# Altium project Huckepack.PrjPcb
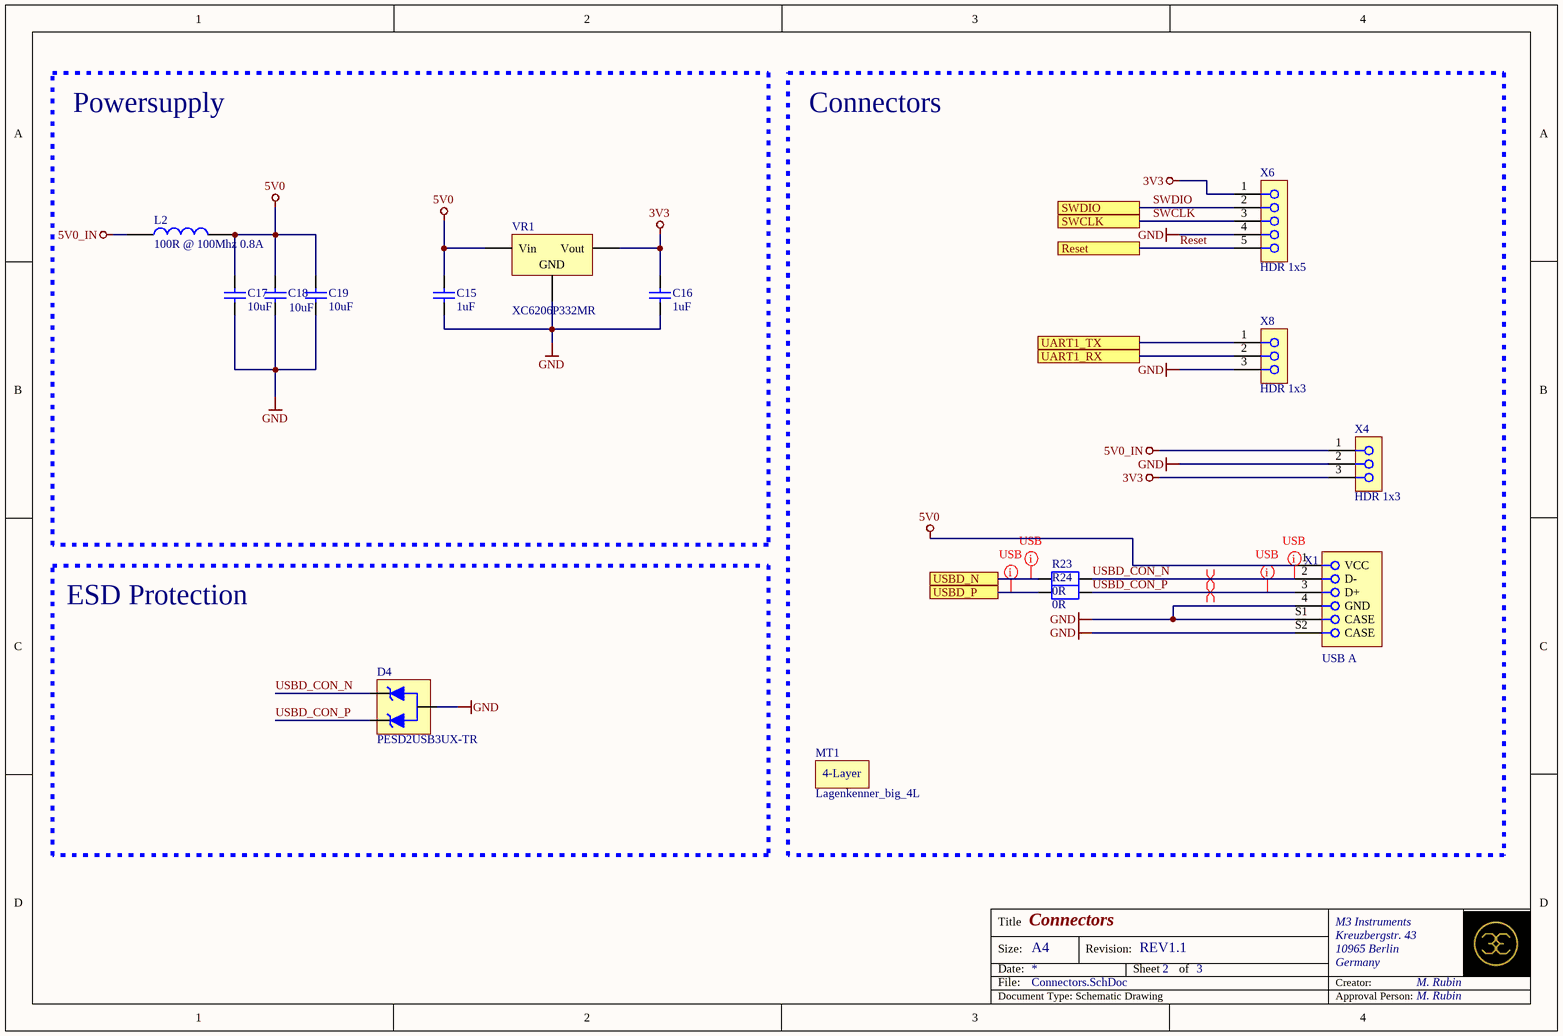
[diagram p0: Connectors.SchDoc]
Address2: Kreuzbergstr. 43; Address3: 10965 Berlin; Address4: Germany; ApprovalSchematic: M. Rubin; CompanyName: M3 Instruments; CreatorSchematic: M. Rubin; ProjectRevision: REV1.1
3 sheets, 167 parts. Net scope: flat (ports and power ports of the same name join across sheets).
Board file: hep-0002.PcbDoc
Sheets:
  Connectors.SchDoc
  MCU.SchDoc
  Audiocodec.SchDoc

## Sheet Connectors.SchDoc: Connectors
size A4; DocumentNumber: 2; SheetNumber: 2; SheetTotal: 3

### Parts
C15  1uF  [0603_C]
C16  1uF  [0603_C]
C17  10uF  [0805_C]
C18  10uF  [0805_C]
C19  10uF  [0805_C]
D4  PESD2USB3UX-TR  [SOT95P280X135-3N_123]
L2  100R @ 100Mhz 0.8A  [6-0805_L]
MT1  Lagenkenner_big_4L  [Lagenkenner_4L-big]
R23  0R  [RESC2012X70N]
R24  0R  [RESC2012X70N]
VR1  XC6206P332MR  [SOT-23-3L]
X1  USB A  [CON_USBA_F_61400416021]
X4  HDR 1x3  [CON_HEADER2.54_1x3W]
X6  HDR 1x5  [CON_HEADER2.54_1x5W]
X8  HDR 1x3  [CON_HEADER2.54_1x3W]

### Blocks framed on the sheet
Powersupply: C15-C19 L2 VR1
Connectors: MT1 R23 R24 X1 X4 X6 X8
ESD Protection: D4

### Ports
Reset, SWCLK, SWDIO, UART1_RX, UART1_TX, USBD_N, USBD_P

### Nets
3V3: C16.2 VR1.2(Vout) X4.3 X6.1
5V0: C15.2 C17.2 C18.2 C19.2 L2.2 VR1.3(Vin) X1.1(VCC)
5V0_IN: L2.1 X4.1
GND: C15.1 C16.1 C17.1 C18.1 C19.1 D4.3 VR1.1(GND) X1.4(GND) X1.S1(CASE) X1.S2(CASE) X4.2 X6.4 X8.3
Reset: X6.5 ; port Reset
SWCLK: X6.3 ; port SWCLK
SWDIO: X6.2 ; port SWDIO
USBD_CON_N: D4.1 R23.2 X1.2(D-)
USBD_CON_P: D4.2 R24.2 X1.3(D+)
USBD_N: R23.1 ; port USBD_N
USBD_P: R24.1 ; port USBD_P
NetIC1_30: X8.1 ; port UART1_TX
NetIC1_31: X8.2 ; port UART1_RX

### Layout directives
differential pair; net class USB; differential pair class USB_Line; rule Differential Pairs Routing [Pref Gap = 0.15mm    Min Gap  = 0.15mm    Max Gap  = 0.15mmPref Width = 0.5mm    Min Width  = 0.15mm    Max Width  = 0.5mm]: USBD_CON_N, USBD_CON_P
net class USB: USBD_CON_N, USBD_CON_P, USBD_N, USBD_P

### Notes on the sheet
- Title
- Size:
- Date:
- File:
- A4
- Revision:
- Sheet
- of
- Creator:
- Document Type: Schematic Drawing
- Approval Person:
- (in symbol Lagenkenner_big_4L) 4-Layer

### Library data of the parts
C15 C16 = 0603 1uF (105) 10% 50V: Chip capacitors; Manufacturer: Samsung Electro-Mechanics; PartNumber: CL10A105KB8NNNC; Tolerance: 10%; Voltage: 50V; ComponentLink1Description: Supplier link; ComponentLink1URL: http://www.szlcsc.com/product/details_16531.html; Package: 0603; Supplier: LC; SuppliersPartNumber: C15849; Capacitance: 1uF
C17-C19 = 0805 10uF (106) 10% 25V: Chip capacitors; Manufacturer: Samsung Electro-Mechanics; PartNumber: CL21A106KAYNNNE; Tolerance: 10%; Voltage: 25V; ComponentLink1Description: Supplier link; ComponentLink1URL: http://www.szlcsc.com/product/details_16532.html; Package: 0805; Supplier: LC; SuppliersPartNumber: C15850; Capacitance: 10uF
D4 = PESD2USB3UX-TR: ESD Suppressors / TVS Diodes DIODE ESD PROT; Manufacturer: Nexperia; Voltage Rating: 3.3V; Alternatives allowed: YES; Manufacturer Part Number: PESD2USB3UX-TR
L2 = 0805 100R@100Mhz 0.8A: Ferrite Bead; Notepad: *; Package: 0805; Supplier: Sunlord; SuppliersPartNumber: C1015
R23 R24 = RES_0R_0805: Thick Film Resistors - SMD 1/8watt ZEROohm Jumper; Manufacturer: Vishay; Manufacturer Part Number: CRCW08050000Z0EA; Voltage Rating: 150V; Tolerance: 1%; Alternatives allowed: YES; JLC: C17477
VR1 = SOT-23 XC6206P332MR: 低压差线性稳压(LDO); ComponentLink1Description: 供应商链接; ComponentLink1URL: http://www.szlcsc.com/product/details_5896.html; Package: SOT-23; Supplier: LC; SuppliersPartNumber: C5446
X1 = CON_USB_A_FEMALE: USB 2.0 Type A Horizontal; Manufacturer Part Number: 61400416021; Manufacturer: WURTH ELEKTRONIK; Lumira Part Number: S-QMS-SPEC-32510; Alternatives allowed: NO; Notes: *; Tolerance: *; Voltage Rating: *
X4 X8 = CON_HEADER_1X3: Board-to-Board-Steckverbinder, 2.54 mm, 3 Kontakt(e), Stiftleiste 1-Reihig; Manufacturer: Samtec; Manufacturer Part Number: TSW-103-07-T-S; Lumira Part Number: S-QMS-SPEC-32502; Alternatives allowed: YES
X6 = CON_HEADER_1X5: Board-to-Board-Steckverbinder, 2.54 mm, 5 Kontakt(e), Stiftleiste 1-Reihig; Manufacturer: Samtec; Manufacturer Part Number: TSW-105-07-T-S; Alternatives allowed: YES

## Sheet MCU.SchDoc: MCU
size A3; DocumentNumber: 1; SheetNumber: 1
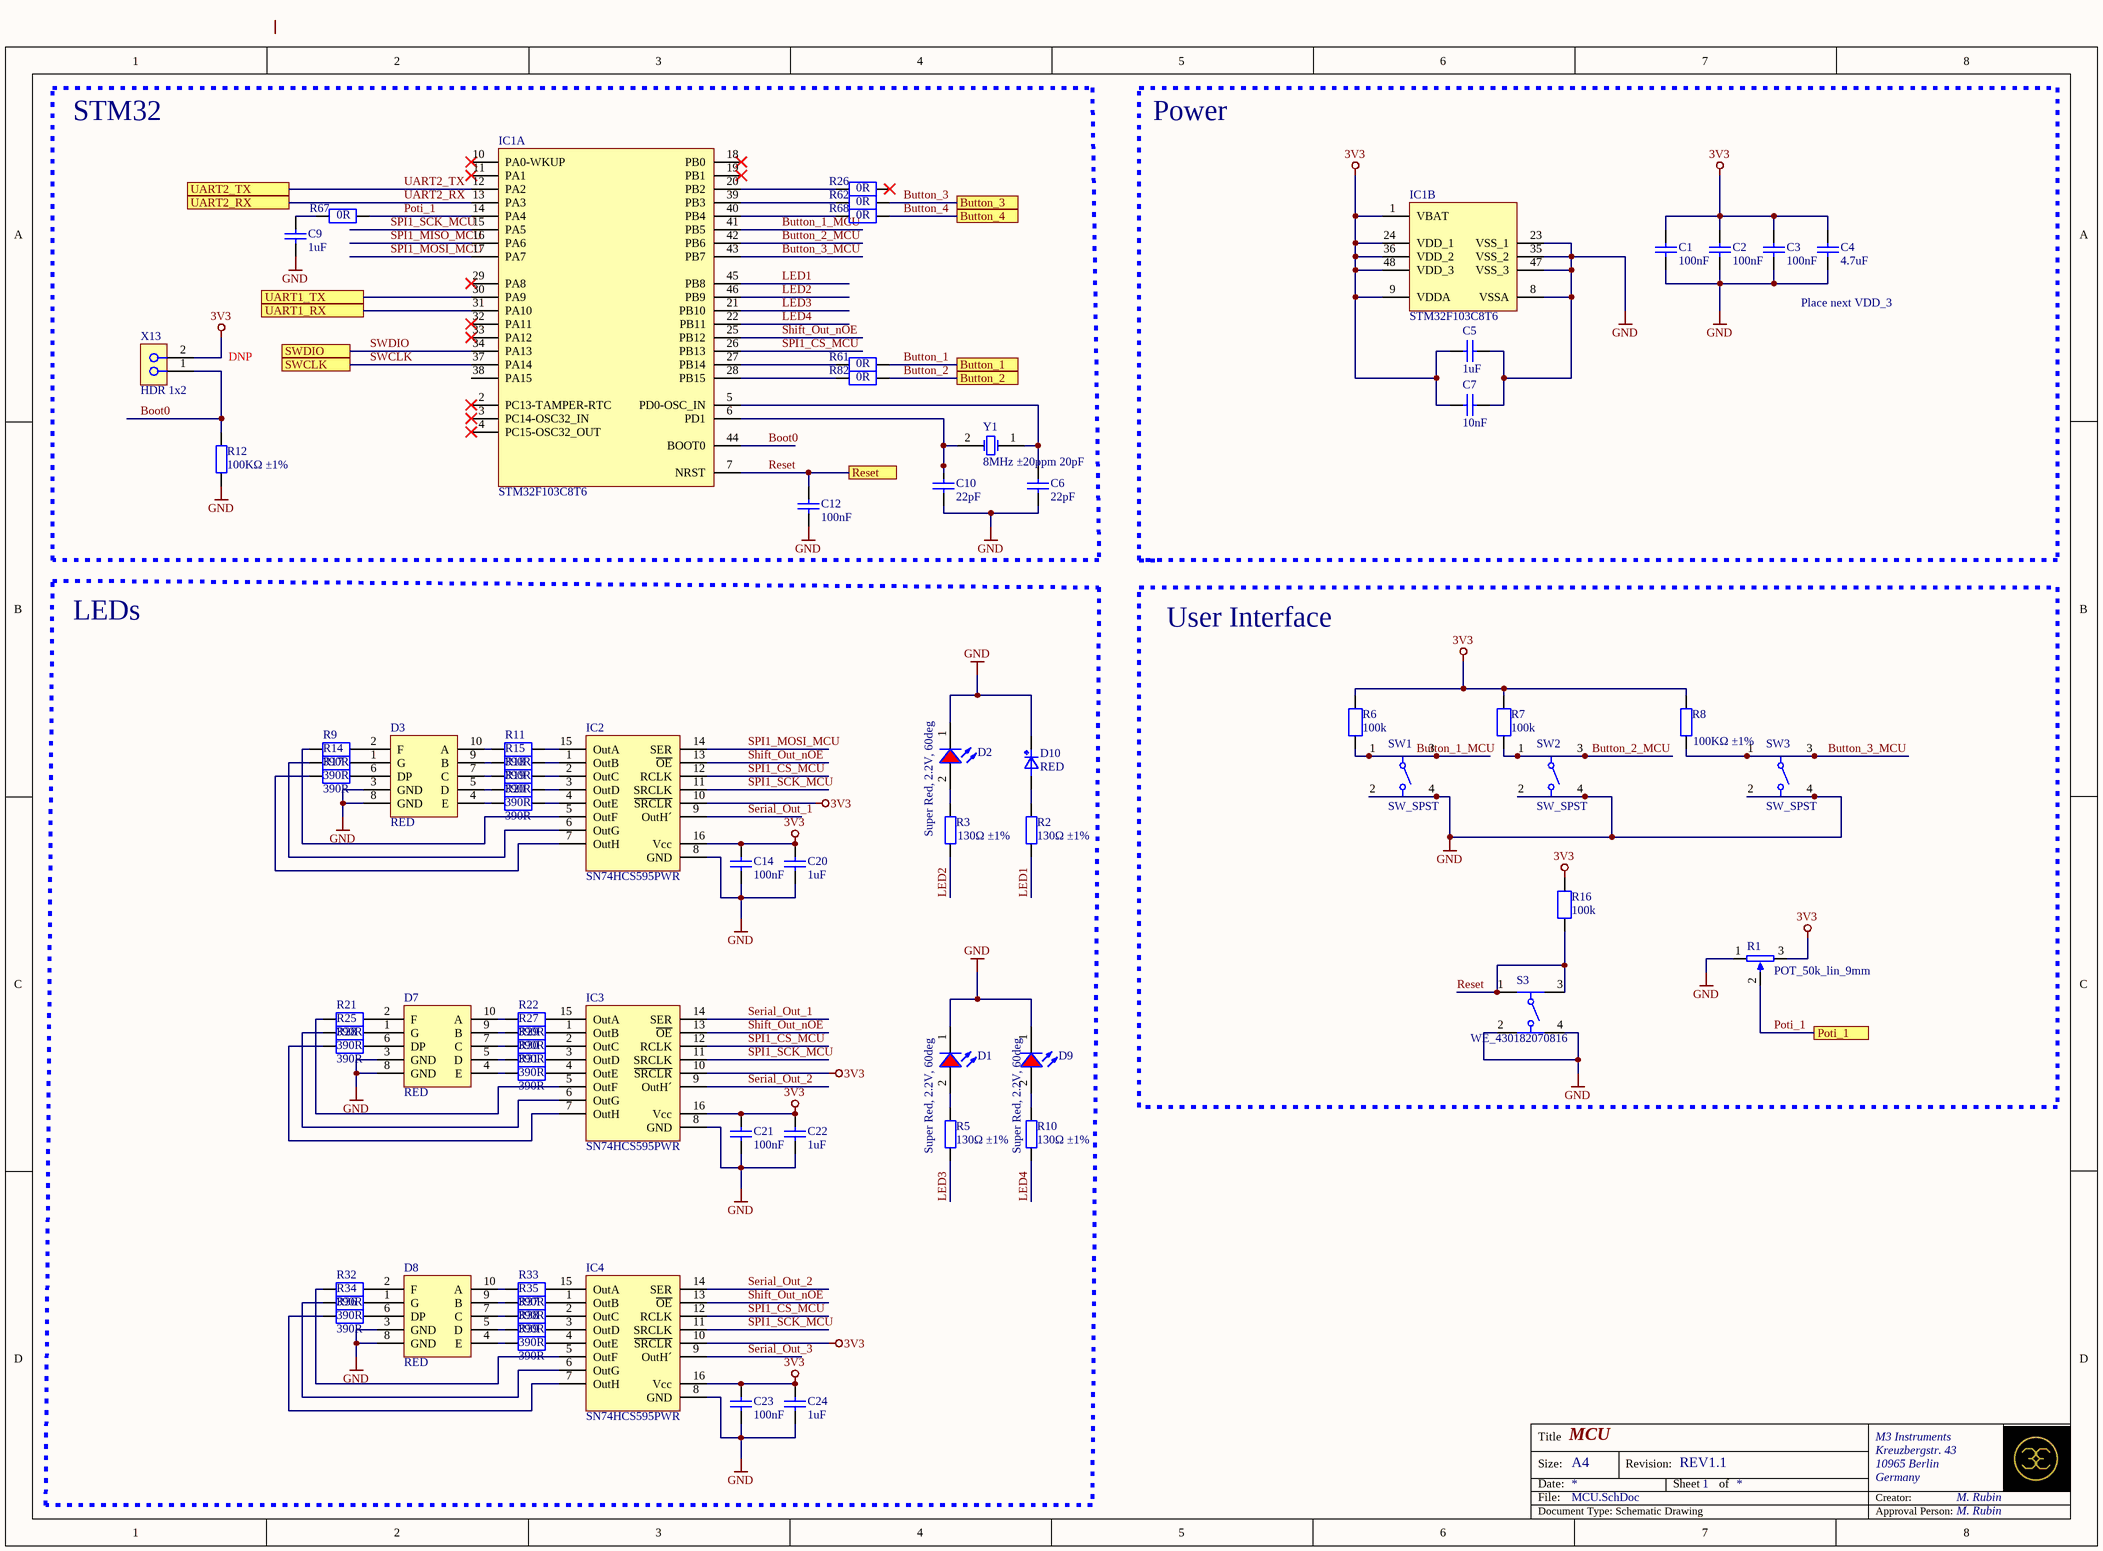
[diagram p1: MCU.SchDoc]

### Parts
C1  100nF  [0603_C]
C2  100nF  [0603_C]
C3  100nF  [0603_C]
C4  4.7uF  [0603_C]
C5  1uF  [0603_C]
C6  22pF  [0603_C]
C7  10nF  [0603_C]
C9  1uF  [0603_C]
C10  22pF  [0603_C]
C12  100nF  [0603_C]
C14  100nF  [0603_C]
C20  1uF  [0603_C]
C21  100nF  [0603_C]
C22  1uF  [0603_C]
C23  100nF  [0603_C]
C24  1uF  [0603_C]
D1  Super Red, 2.2V, 60deg  [WL-TMRC_3mm_10mm_space]
D2  Super Red, 2.2V, 60deg  [WL-TMRC_3mm_10mm_space]
D3  RED  [LTS-4301WC]
D7  RED  [LTS-4301WC]
D8  RED  [LTS-4301WC]
D9  Super Red, 2.2V, 60deg  [WL-TMRC_3mm_10mm_space]
D10  RED  [WL-SMCW_0805]
IC1  STM32F103C8T6  [LQFP-48_7x7x05P]  (parts A,B of 2)
IC2  SN74HCS595PWR  [TSOP65P640X120-16N_2]
IC3  SN74HCS595PWR  [TSOP65P640X120-16N_2]
IC4  SN74HCS595PWR  [TSOP65P640X120-16N_2]
R1  POT_50k_lin_9mm  [PTV09]
R2  130Ω ±1%  [0603_R]
R3  130Ω ±1%  [0603_R]
R5  130Ω ±1%  [0603_R]
R6  100k  [RESC2012X70N]
R7  100k  [RESC2012X70N]
R8  100KΩ ±1%  [0603_R]
R9  390R  [RESC2012X70N]
R10  130Ω ±1%  [0603_R]
R11  390R  [RESC2012X70N]
R12  100KΩ ±1%  [0603_R]
R14  390R  [RESC2012X70N]
R15  390R  [RESC2012X70N]
R16  100k  [RESC2012X70N]
R17  390R  [RESC2012X70N]
R18  390R  [RESC2012X70N]
R19  390R  [RESC2012X70N]
R20  390R  [RESC2012X70N]
R21  390R  [RESC2012X70N]
R22  390R  [RESC2012X70N]
R25  390R  [RESC2012X70N]
R26  0R  [RESC1608X55N]
R27  390R  [RESC2012X70N]
R28  390R  [RESC2012X70N]
R29  390R  [RESC2012X70N]
R30  390R  [RESC2012X70N]
R31  390R  [RESC2012X70N]
R32  390R  [RESC2012X70N]
R33  390R  [RESC2012X70N]
R34  390R  [RESC2012X70N]
R35  390R  [RESC2012X70N]
R36  390R  [RESC2012X70N]
R37  390R  [RESC2012X70N]
R38  390R  [RESC2012X70N]
R39  390R  [RESC2012X70N]
R61  0R  [RESC1608X55N]
R62  0R  [RESC1608X55N]
R67  0R  [RESC1608X55N]
R68  0R  [RESC1608X55N]
R82  0R  [RESC1608X55N]
S3  WE_430182070816  [430182070816]
SW1  SW_SPST  [TL1105D]
SW2  SW_SPST  [TL1105D]
SW3  SW_SPST  [TL1105D]
X13  HDR 1x2  [CON_HEADER2.54_1x2W]
Y1  8MHz ±20ppm 20pF  [SMD-5032_2P]

### Blocks framed on the sheet
STM32: C6 C9 C10 C12 IC1 R12 R26 R61 R62 R67 R68 R82 X13 Y1
LEDs: C14 C20-C24 D1-D3 D7-D10 IC2-IC4 R2 R3 R5 R9-R11 R14 R15 R17-R22 R25 R27-R39
User Interface: R1 R6-R8 R16 S3 SW1-SW3

### Ports
Button_1, Button_2, Button_3, Button_4, Poti_1, Reset, SWCLK, SWDIO, UART1_RX, UART1_TX, UART2_RX, UART2_TX

### Nets
3V3: C1.2 C2.2 C3.2 C4.2 C5.1 C7.1 C14.2 C20.2 C21.2 C22.2 C23.2 C24.2 IC1.1(VBAT) IC1.9(VDDA) IC1.24(VDD_1) IC1.36(VDD_2) IC1.48(VDD_3) IC2.10(~{SRCLR}) IC2.16(Vcc) IC3.10(~{SRCLR}) IC3.16(Vcc) IC4.10(~{SRCLR}) IC4.16(Vcc) R1.3 R6.2 R7.2 R8.2 R16.2 X13.2
GND: C1.1 C2.1 C3.1 C4.1 C5.2 C6.2 C7.2 C9.2 C10.2 C12.1 C14.1 C20.1 C21.1 C22.1 C23.1 C24.1 D1.1(K) D2.1(K) D3.3(GND) D3.8(GND) D7.3(GND) D7.8(GND) D8.3(GND) D8.8(GND) D9.1(K) D10.K IC1.8(VSSA) IC1.23(VSS_1) IC1.35(VSS_2) IC1.47(VSS_3) IC2.8(GND) IC3.8(GND) IC4.8(GND) R1.1 R12.1 S3.2 S3.4 SW1.2 SW1.4 SW2.2 SW2.4 SW3.2 SW3.4
Boot0: IC1.44(BOOT0) R12.2 X13.1
Button_1: R61.2 ; port Button_1
Button_1_MCU: IC1.41(PB5) R6.1 SW1.1 SW1.3
Button_2: R82.2 ; port Button_2
Button_2_MCU: IC1.42(PB6) R7.1 SW2.1 SW2.3
Button_3: R62.2 ; port Button_3
Button_3_MCU: IC1.43(PB7) R8.1 SW3.1 SW3.3
Button_4: R68.2 ; port Button_4
LED1: IC1.45(PB8) R2.2
LED2: IC1.46(PB9) R3.2
LED3: IC1.21(PB10) R5.2
LED4: IC1.22(PB11) R10.2
Poti_1: IC1.14(PA4) R1.2 R67.2 ; port Poti_1
Reset: C12.2 IC1.7(NRST) R16.1 S3.1 S3.3 ; port Reset
Serial_Out_1: IC2.9(OutH´) IC3.14(SER)
Serial_Out_2: IC3.9(OutH´) IC4.14(SER)
Serial_Out_3: IC4.9(OutH´)
Shift_Out_nOE: IC1.25(PB12) IC2.13(~{OE}) IC3.13(~{OE}) IC4.13(~{OE})
SPI1_CS_MCU: IC1.26(PB13) IC2.12(RCLK) IC3.12(RCLK) IC4.12(RCLK)
SPI1_MISO_MCU: IC1.16(PA6)
SPI1_MOSI_MCU: IC1.17(PA7) IC2.14(SER)
SPI1_SCK_MCU: IC1.15(PA5) IC2.11(SRCLK) IC3.11(SRCLK) IC4.11(SRCLK)
SWCLK: IC1.37(PA14) ; port SWCLK
SWDIO: IC1.34(PA13) ; port SWDIO
UART2_RX: IC1.13(PA3) ; port UART2_RX
UART2_TX: IC1.12(PA2) ; port UART2_TX
NetC6_1: C6.1 IC1.5(PD0-OSC_IN) Y1.1(OSC1)
NetC9_1: C9.1 R67.1
NetC10_1: C10.1 IC1.6(PD1) Y1.2(OSC2)
NetD1_2: D1.2(A) R5.1
NetD2_2: D2.2(A) R3.1
NetD3_1: D3.1(G) R14.2
NetD3_2: D3.2(F) R9.2
NetD3_4: D3.4(E) R20.1
NetD3_5: D3.5(D) R19.1
NetD3_6: D3.6(DP) R17.2
NetD3_7: D3.7(C) R18.1
NetD3_9: D3.9(B) R15.1
NetD3_10: D3.10(A) R11.1
NetD7_1: D7.1(G) R25.2
NetD7_2: D7.2(F) R21.2
NetD7_4: D7.4(E) R31.1
NetD7_5: D7.5(D) R30.1
NetD7_6: D7.6(DP) R28.2
NetD7_7: D7.7(C) R29.1
NetD7_9: D7.9(B) R27.1
NetD7_10: D7.10(A) R22.1
NetD8_1: D8.1(G) R34.2
NetD8_2: D8.2(F) R32.2
NetD8_4: D8.4(E) R39.1
NetD8_5: D8.5(D) R38.1
NetD8_6: D8.6(DP) R36.2
NetD8_7: D8.7(C) R37.1
NetD8_9: D8.9(B) R35.1
NetD8_10: D8.10(A) R33.1
NetD9_2: D9.2(A) R10.1
NetD10_A: D10.A R2.1
NetIC1_20: IC1.20(PB2) R26.1
NetIC1_27: IC1.27(PB14) R61.1
NetIC1_28: IC1.28(PB15) R82.1
NetIC1_30: IC1.30(PA9) ; port UART1_TX
NetIC1_31: IC1.31(PA10) ; port UART1_RX
NetIC1_39: IC1.39(PB3) R62.1
NetIC1_40: IC1.40(PB4) R68.1
NetIC2_1: IC2.1(OutB) R15.2
NetIC2_2: IC2.2(OutC) R18.2
NetIC2_3: IC2.3(OutD) R19.2
NetIC2_4: IC2.4(OutE) R20.2
NetIC2_5: IC2.5(OutF) R9.1
NetIC2_6: IC2.6(OutG) R14.1
NetIC2_7: IC2.7(OutH) R17.1
NetIC2_15: IC2.15(OutA) R11.2
NetIC3_1: IC3.1(OutB) R27.2
NetIC3_2: IC3.2(OutC) R29.2
NetIC3_3: IC3.3(OutD) R30.2
NetIC3_4: IC3.4(OutE) R31.2
NetIC3_5: IC3.5(OutF) R21.1
NetIC3_6: IC3.6(OutG) R25.1
NetIC3_7: IC3.7(OutH) R28.1
NetIC3_15: IC3.15(OutA) R22.2
NetIC4_1: IC4.1(OutB) R35.2
NetIC4_2: IC4.2(OutC) R37.2
NetIC4_3: IC4.3(OutD) R38.2
NetIC4_4: IC4.4(OutE) R39.2
NetIC4_5: IC4.5(OutF) R32.1
NetIC4_6: IC4.6(OutG) R34.1
NetIC4_7: IC4.7(OutH) R36.1
NetIC4_15: IC4.15(OutA) R33.2

Not connected (* = marked no-connect by the designer): IC1 2(PC13-TAMPER-RTC)* 3(PC14-OSC32_IN)* 4(PC15-OSC32_OUT)* 10(PA0-WKUP)* 11(PA1)* 18(PB0)* 19(PB1)* 29(PA8)* 32(PA11)* 33(PA12)* 38(PA15); R26 2*

### Notes on the sheet
- Power
- DNP
- Place next VDD_3
- Title
- Size:
- Date:
- File:
- A4
- Revision:
- Sheet
- of
- Creator:
- Document Type: Schematic Drawing
- Approval Person:

### Library data of the parts
C1-C3 C12 C14 C21 C23 = 0603 100nF (104) 10% 50V: Chip capacitors; Manufacturer: YAGEO; PartNumber: CC0603KRX7R9BB104; Tolerance: 10%; Voltage: 50V; ComponentLink1Description: Supplier link; ComponentLink1URL: http://www.szlcsc.com/product/details_15331.html; Package: 0603; Supplier: LC; SuppliersPartNumber: C14663; Capacitance: 100nF
C4 = 0603 4.7uF (475) 10% 16V: Chip capacitors; Manufacturer: Samsung Electro-Mechanics; PartNumber: CL10A475KO8NNNC; Tolerance: 10%; Voltage: 16V; ComponentLink1Description: Supplier link; ComponentLink1URL: http://www.szlcsc.com/product/details_20375.html; Package: 0603; Supplier: LC; SuppliersPartNumber: C19666; Capacitance: 4.7uF
C5 C9 C20 C22 C24 = 0603 1uF (105) 10% 50V: as C15 on sheet Connectors; ComponentLink1Description: Supplier link; ComponentLink1URL: http://www.szlcsc.com/product/details_16531.html; Package: 0603; Supplier: LC; SuppliersPartNumber: C15849; Capacitance: 1uF
C6 C10 = 0603 22pF (220) 5% 50V: Chip capacitors; Manufacturer: Samsung Electro-Mechanics; PartNumber: CL10C220JB8NNNC; Tolerance: 5%; Voltage: 50V; ComponentLink1Description: Supplier link; ComponentLink1URL: http://www.szlcsc.com/product/details_2005.html; Package: 0603; Supplier: LC; SuppliersPartNumber: C1653; Capacitance: 22pF
C7 = 0603 10nF (103) 10% 50V: Chip capacitors; Manufacturer: Guangdong Fenghua Advanced Tech; PartNumber: 0603B103K500NT; Tolerance: 10%; Voltage: 50V; ComponentLink1Description: Supplier link; ComponentLink1URL: http://www.szlcsc.com/product/details_58143.html; Package: 0603; Supplier: LC; SuppliersPartNumber: C57112; Capacitance: 10nF
D1 D2 D9 = 151031SS06000_Spacer_10mm: WL-TMRC THT Mono-color Round Color, size 3mm, Super Red, 2.2V, 60deg; Luminous Intensity: 35mcd; Dominant Wavelength: 640nm; Peak Wavelength: 650nm; Chip Technology: AlGaAs; ComponentLink1Description: Manufacturer; ComponentLink1URL: http://www.we-online.de; ComponentLink2Description: Datasheet; ComponentLink2URL: https://katalog.we-online.de/led/datasheet/151031SS06000.pdf; Emitting Color: Super Red; Operating Temperature: -40 to +85degC; Mounting Technology: THT; Forward Voltage: 2.2V; Part Number: 151031SS06000; Packaging: Bulk; Published Date: October 2019; Publisher: Wurth Elektronik; Size: 3mm; Viewing Angle: 60deg
D3 D7 D8 = 7-SEGMENT-10mm: LED Displays & Accessories 1-Digit SMD Display Red Low-Cur .40; Manufacturer: Lite-On; Alternatives allowed: YES; Manufacturer Part Number: LTS-4301WC; JLC: C84256
D10 = LED_0805_RED_AK: Standard LEDs - SMD WL-SMCW SMDMono TpVw Waterclr 0805 Red; Manufacturer: Wurth Elektronik; Manufacturer Part Number: 150080RS75000; Voltage Rating: 2.0; Alternatives allowed: YES; JLC: C84256
IC1 = STM32F103C8T6: ARM; Manufacturer: STMicroelectronics; ComponentLink1Description: 供应商链接; ComponentLink1URL: http://www.szlcsc.com/product/details_9243.html; Manufacturer Part Number: STM32F103C8T6; JLC: C8734
IC2-IC4 = IC_SN74HCS595: Counter Shift Registers 8-bit serial-in/parallel-out shift register 16-TSSOP -40 to 125; Manufacturer: Texas Instruments; Alternatives allowed: NO; Manufacturer Part Number: SN74HCS595PWR
R1 = POT_50k_lin_9mm: Potentiometers PANEL CONTROL - 9MM-ST-CA 50 kohms 30 mm; Manufacturer: Bourns; Manufacturer Part Number: PTV09A-4030S-A503; Tolerance: 20%
R2 R3 R5 R10 = 0603 130R (1300) 1%: Chip resistor; Manufacturer: Uniroyal Elec; PartNumber: 0603WAF1300T5E; Power: 1/10W; ComponentLink1Description: Supplier link; ComponentLink1URL: http://www.szlcsc.com/product/details_23523.html; Package: 0603; Supplier: LC; SuppliersPartNumber: C22796; Resistance: 130Ω; Tolerance: 1%
R6 R7 R16 = RES_100k_0805: Thick Film Resistors - SMD 1/8watt 100Kohms 1% 100ppm; Manufacturer: Vishay / Dale; Manufacturer Part Number: CRCW0805100KFKEA; Voltage Rating: 150V; Alternatives allowed: YES; Tolerance: 1%; JLC: C17407
R8 R12 = 0603 100K (1003) 1%: Chip resistor; Manufacturer: Uniroyal Elec; PartNumber: 0603WAF1003T5E; Power: 1/10W; ComponentLink1Description: Supplier link; ComponentLink1URL: http://www.szlcsc.com/product/details_26546.html; Package: 0603; Supplier: LC; SuppliersPartNumber: C25803; Resistance: 100KΩ; Tolerance: 1%
R9 R11 R14 R15 R17-R22 R25 R27-R39 = RES_390R_0805: Thick Film Resistors - SMD 1/8Watt 390ohms 1% Commercial Use; Manufacturer: Vishay / Dale; Manufacturer Part Number: CRCW0805390RFKEA; Voltage Rating: 150V; Alternatives allowed: YES; Tolerance: 1%; JLC: C17655
R26 R61 R62 R67 R68 R82 = RES_0R_0603: Thick Film Resistors - SMD 1/10watt ZEROohm Jumper; Manufacturer: Vishay; Manufacturer Part Number: CRCW06030000Z0EA; Voltage Rating: 75V; Tolerance: 1%; Alternatives allowed: YES
S3 = WE_430182070816: WS-TASV SMT Tact Switch 6x6mm, height 7mm, 160gf; Rated Voltage: 12VDC; Rated Current: 50mA; Washable: No; ComponentLink1Description: Manufacturer; ComponentLink1URL: http://www.we-online.de; ComponentLink2Description: Datasheet; ComponentLink2URL: https://katalog.we-online.com/em/datasheet/430182070816.pdf; Operating Temperature: -40 to +85degC; Part Number: 430182070816; Published Date: September 2019; Contact Material: Stainless Steel; Height: 7mm; Mounting Technology: SMT; Contact Plating: Silver; Operation Force: 160gf; Packaging: Tape and Reel; Terminal Material: Copper Alloy; Publisher: Wurth Elektronik; Terminal Plating: Silver
SW1-SW3 = SW_ TL1105DF160Q: Tastschalter SPST-Schließer Von oben betätigt Durchkontaktierung; Manufacturer: E-Switch; Alternatives allowed: NO; Manufacturer Part Number: TL1105DF160Q
X13 = CON_HEADER_1X2: Board-to-Board-Steckverbinder, 2.54 mm, 2 Kontakt(e), Stiftleiste 1-Reihig; Manufacturer: Samtec; Manufacturer Part Number: TSW-102-07-T-S; Lumira Part Number: S-QMS-SPEC-32507; Alternatives allowed: YES
Y1 = SMD-5032_2P 8MHz 20ppm 20pF: 贴片晶振; ComponentLink1Description: 供应商链接; ComponentLink1URL: http://www.szlcsc.com/product/details_117214.html; Package: SMD-5032_2P; Supplier: LC; SuppliersPartNumber: C115962

## Sheet Audiocodec.SchDoc: Audiocodec
size A3; DocumentNumber: 3; SheetNumber: 3
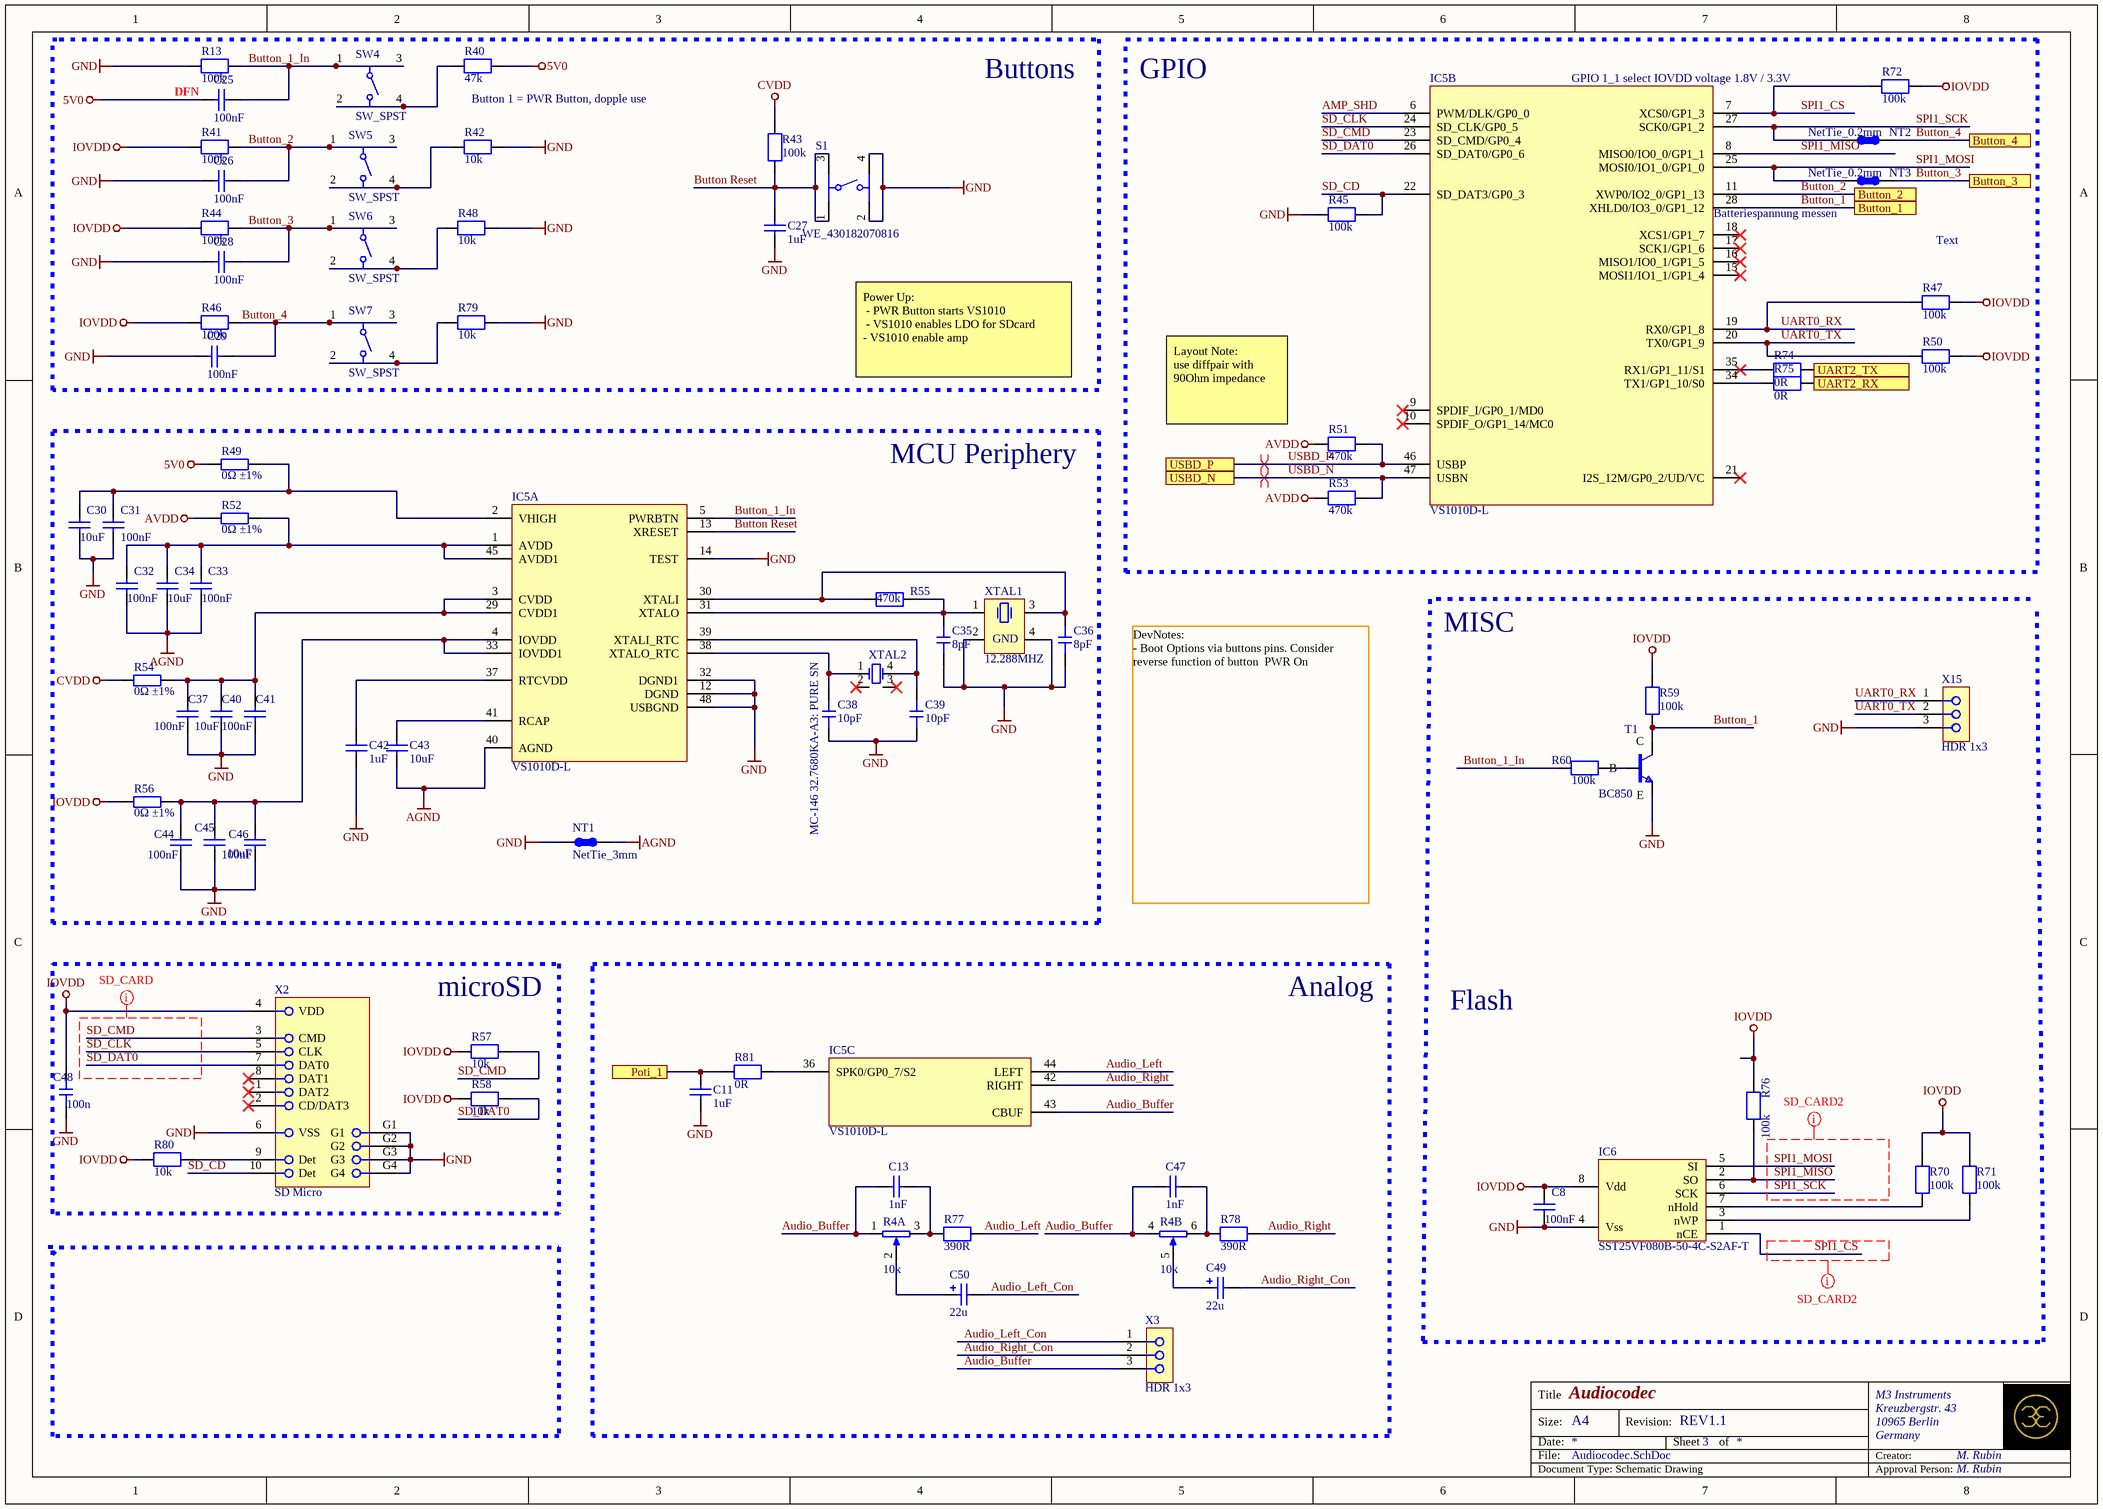
[diagram p2: Audiocodec.SchDoc]

### Parts
C8  100nF  [CAPC1608X95N]
C11  1uF  [CAPC2012X145N]
C13  1nF  [CAPC2012X145N]
C25  100nF  [CAPC1608X95N]
C26  100nF  [CAPC1608X95N]
C27  1uF  [CAPC2012X145N]
C28  100nF  [CAPC1608X95N]
C29  100nF  [CAPC1608X95N]
C30  10uF  [CAPC2012X145N]
C31  100nF  [CAPC1608X95N]
C32  100nF  [CAPC1608X95N]
C33  100nF  [CAPC1608X95N]
C34  10uF  [CAPC2012X145N]
C35  8pF  [CAPC1005X55]
C36  8pF  [CAPC1005X55]
C37  100nF  [CAPC1608X95N]
C38  10pF  [CAPC1005X55]
C39  10pF  [CAPC1005X55]
C40  10uF  [CAPC2012X145N]
C41  100nF  [CAPC1608X95N]
C42  1uF  [CAPC2012X145N]
C43  10uF  [CAPC2012X145N]
C44  100nF  [CAPC1608X95N]
C45  10uF  [CAPC2012X145N]
C46  100nF  [CAPC1608X95N]
C47  1nF  [CAPC2012X145N]
C48  100n  [CAPC1005X55]
C49  22u  [CAPAE4643X54M]
C50  22u  [CAPAE4643X54M]
IC5  VS1010D-L  [TSQFP50P900X900X160-48N]  (parts A,B,C of 3)
IC6  SST25VF080B-50-4C-S2AF-T  [SOIC127P790X216-8N]
NT1  NetTie_3mm  [NET_TIE_3MM]  (net tie, no BOM)
NT2  NetTie_0.2mm  [NET_TIE_0.2MM]  (net tie, no BOM)
NT3  NetTie_0.2mm  [NET_TIE_0.2MM]  (net tie, no BOM)
R4  10k  [rk12l123]  (parts A,B of 2)
R13  100k  [RESC2012X70N]
R40  47k  [RESC2012X70N]
R41  100k  [RESC2012X70N]
R42  10k  [RESC2012X70N]
R43  100k  [RESC2012X70N]
R44  100k  [RESC2012X70N]
R45  100k  [RESC2012X70N]
R46  100k  [RESC2012X70N]
R47  100k  [RESC2012X70N]
R48  10k  [RESC2012X70N]
R49  0Ω ±1%  [RESC2012X70N]
R50  100k  [RESC2012X70N]
R51  470k  [RESC2012X70N]
R52  0Ω ±1%  [RESC2012X70N]
R53  470k  [RESC2012X70N]
R54  0Ω ±1%  [RESC2012X70N]
R55  470k  [RESC2012X70N]
R56  0Ω ±1%  [RESC2012X70N]
R57  10k  [RESC2012X70N]
R58  10k  [RESC2012X70N]
R59  100k  [RESC1608X55N]
R60  100k  [RESC1608X55N]
R70  100k  [RESC2012X70N]
R71  100k  [RESC2012X70N]
R72  100k  [RESC2012X70N]
R74  0R  [RESC1608X55N]
R75  0R  [RESC1608X55N]
R76  100k  [RESC2012X70N]
R77  390R  [RESC2012X70N]
R78  390R  [RESC2012X70N]
R79  10k  [RESC2012X70N]
R80  10k  [RESC2012X70N]
R81  0R  [RESC1608X55N]
S1  WE_430182070816  [430182070816]
SW4  SW_SPST  [TL1105D]
SW5  SW_SPST  [TL1105D]
SW6  SW_SPST  [TL1105D]
SW7  SW_SPST  [TL1105D]
T1  BC850  [SOT95P280X135-3N_BEC]
X2  SD Micro  [MOLEX_104031-0811]
X3  HDR 1x3  [CON_HEADER2.54_1x3W]
X15  HDR 1x3  [CON_HEADER2.54_1x3W]
XTAL1  12.288MHZ  [XTAL_ECS-122.8-10-33-AGL-TR]
XTAL2  MC-146 32.7680KA-A3: PURE SN  [Epson_MC-146]

### Blocks framed on the sheet
Buttons: C25-C29 R13 R40-R44 R46 R48 R79 S1 SW4-SW7
GPIO: IC5 NT2 NT3 R45 R47 R50 R51 R53 R72 R74 R75
MCU Periphery: C30-C46 IC5 NT1 R49 R52 R54-R56 XTAL1 XTAL2
microSD: C48 R57 R58 R80 X2

### Ports
Button_1, Button_2, Button_3, Button_4, Poti_1, UART2_RX, UART2_TX, USBD_N, USBD_P

### Nets
5V0: C25.2 R40.2 R49.1
AGND: C32.1 C33.1 C34.1 C43.1 IC5.40(AGND) NT1.1
AVDD: R51.1 R52.1 R53.1
CVDD: R43.2 R54.1
GND: C8.1 C11.1 C26.2 C27.1 C28.2 C29.2 C30.1 C31.1 C35.1 C36.1 C37.1 C38.1 C39.1 C40.1 C41.1 C42.1 C44.1 C45.1 C46.1 C48.2 IC5.12(DGND) IC5.14(TEST) IC5.32(DGND1) IC5.48(USBGND) IC6.4(Vss) NT1.2 R13.1 R42.2 R45.2 R48.2 R79.2 S1.2 S1.4 T1.E X2.6(VSS) X2.G1 X2.G2 X2.G3 X2.G4 X15.3 XTAL1.2(nc) XTAL1.4(NC)
IOVDD: C8.2 C48.1 IC6.8(Vdd) R41.1 R44.1 R46.1 R47.2 R50.2 R56.1 R57.1 R58.1 R59.1 R70.2 R71.2 R72.2 R76.2 R80.1 X2.4(VDD)
AMP_SHD: IC5.6(PWM/DLK/GP0_0)
Audio_Buffer: C13.1 C47.1 IC5.43(CBUF) R4.1 R4.4 X3.3
Audio_Left: IC5.44(LEFT) R77.2
Audio_Left_Con: C50.2 X3.1
Audio_Right: IC5.42(RIGHT) R78.2
Audio_Right_Con: C49.2 X3.2
Button Reset: C27.2 IC5.13(XRESET) R43.1 S1.1 S1.3
Button_1: IC5.28(XHLD0/IO3_0/GP1_12) R59.2 T1.C ; port Button_1
Button_1_In: C25.1 IC5.5(PWRBTN) R13.2 R60.2 SW4.1 SW4.3
Button_2: C26.1 IC5.11(XWP0/IO2_0/GP1_13) R41.2 SW5.1 SW5.3 ; port Button_2
Button_3: C28.1 NT3.1 R44.2 SW6.1 SW6.3 ; port Button_3
Button_4: C29.1 NT2.1 R46.2 SW7.1 SW7.3 ; port Button_4
Poti_1: C11.2 R81.1 ; port Poti_1
SD_CD: IC5.22(SD_DAT3/GP0_3) R45.1 X2.10(Det)
SD_CLK: IC5.24(SD_CLK/GP0_5) X2.5(CLK)
SD_CMD: IC5.23(SD_CMD/GP0_4) R57.2 X2.3(CMD)
SD_DAT0: IC5.26(SD_DAT0/GP0_6) R58.2 X2.7(DAT0)
SPI1_CS: IC5.7(XCS0/GP1_3) IC6.1(nCE) R72.1
SPI1_MISO: IC5.8(MISO0/IO0_0/GP1_1) IC6.2(SO) R76.1
SPI1_MOSI: IC5.25(MOSI0/IO1_0/GP1_0) IC6.5(SI) NT3.2
SPI1_SCK: IC5.27(SCK0/GP1_2) IC6.6(SCK) NT2.2
UART0_RX: IC5.19(RX0/GP1_8) R47.1 X15.1
UART0_TX: IC5.20(TX0/GP1_9) R50.1 X15.2
UART2_RX: R75.2 ; port UART2_RX
UART2_TX: R74.2 ; port UART2_TX
USBD_N: IC5.47(USBN) R53.2 ; port USBD_N
USBD_P: IC5.46(USBP) R51.2 ; port USBD_P
NetC13_2: C13.2 R4.3 R77.1
NetC30_2: C30.2 C31.2 IC5.2(VHIGH) R49.2
NetC32_2: C32.2 C33.2 C34.2 IC5.1(AVDD) IC5.45(AVDD1) R52.2
NetC35_2: C35.2 IC5.31(XTALO) R55.2 XTAL1.1(OSC1)
NetC36_2: C36.2 IC5.30(XTALI) R55.1 XTAL1.3(OSC2)
NetC37_2: C37.2 C40.2 C41.2 IC5.3(CVDD) IC5.29(CVDD1) R54.2
NetC38_2: C38.2 IC5.38(XTALO_RTC) XTAL2.1(OSC1)
NetC39_2: C39.2 IC5.39(XTALI_RTC) XTAL2.4(OSC2)
NetC42_2: C42.2 IC5.37(RTCVDD)
NetC43_2: C43.2 IC5.41(RCAP)
NetC44_2: C44.2 C45.2 C46.2 IC5.4(IOVDD) IC5.33(IOVDD1) R56.2
NetC47_2: C47.2 R4.6 R78.1
NetC49_1: C49.1 R4.5
NetC50_1: C50.1 R4.2
NetIC5_34: IC5.34(TX1/GP1_10/S0) R75.1
NetIC5_35: IC5.35(RX1/GP1_11/S1) R74.1
NetIC5_36: IC5.36(SPK0/GP0_7/S2) R81.2
NetIC6_3: IC6.3(nWP) R71.1
NetIC6_7: IC6.7(nHold) R70.1
NetR40_1: R40.1 SW4.2 SW4.4
NetR42_1: R42.1 SW5.2 SW5.4
NetR48_1: R48.1 SW6.2 SW6.4
NetR60_1: R60.1 T1.B
NetR79_1: R79.1 SW7.2 SW7.4
NetR80_2: R80.2 X2.9(Det)

Not connected (* = marked no-connect by the designer): IC5 9(SPDIF_I/GP0_1/MD0)* 10(SPDIF_O/GP1_14/MC0)* 15(MOSI1/IO1_1/GP1_4)* 16(MISO1/IO0_1/GP1_5)* 17(SCK1/GP1_6)* 18(XCS1/GP1_7)* 21(I2S_12M/GP0_2/UD/VC)*; X2 1(DAT2)* 2(CD/DAT3)* 8(DAT1)*; XTAL2 2(nc)* 3(NC)*

### Layout directives
differential pair; net class USB; differential pair class USB_Line; rule Differential Pairs Routing [Pref Gap = 0.15mm    Min Gap  = 0.15mm    Max Gap  = 0.15mmPref Width = 0.5mm    Min Width  = 0.15mm    Max Width  = 0.5mm]: USBD_N, USBD_P
net class SD_CARD; rule Matched Net Lengths [Tolerance = 0.5mm]: SD_CLK, SD_CMD, SD_DAT0
net class SD_CARD2; rule Matched Net Lengths [Tolerance = 0.5mm]: SPI1_CS, SPI1_MISO, SPI1_MOSI, SPI1_SCK

### Notes on the sheet
- DFN
- Button 1 = PWR Button, dopple use
- (near IC5) GPIO 1_1 select IOVDD voltage 1.8V / 3.3V
- (near IC5) Batteriespannung messen
- Text
- Power Up:
  - PWR Button starts VS1010
  - VS1010 enables LDO for SDcard
  - VS1010 enable amp
- (near R51) Layout Note:
  use diffpair with 90Ohm impedance
- MISC
- DevNotes:
  - Boot Options via buttons pins. Consider reverse function of button  PWR On
- Analog
- Flash
- Title
- Size:
- Date:
- File:
- A4
- Revision:
- Sheet
- of
- Creator:
- Document Type: Schematic Drawing
- Approval Person:
- (in symbol XTAL_ECS-122.8-10-33-AGL-TR) GND

### Library data of the parts
C8 C25 C26 C28 C29 C31-C33 C37 C41 C44 C46 = CAP_100nF_0603: Multilayer Ceramic Capacitors MLCC - SMD/SMT, 100nF; Manufacturer: YAGEO; Manufacturer Part Number: CC0603KRX7R9BB104; Voltage Rating: 50VDC; Tolerance: 10%; Alternatives allowed: yes; JLC: C14663
C11 C27 C42 = CAP_1uF_0805: Multilayer Ceramic Capacitors MLCC - SMD/SMT, 1uF; Manufacturer: Samsung Electro-Mechanics; Manufacturer Part Number: CL21B105KBFNNNE; Voltage Rating: 50V; Tolerance: 10%; Alternatives allowed: yes; JLC: C28323
C13 C47 = CAP_1nF_630V: Multilayer Ceramic Capacitors MLCC - SMD/SMT - SMD/SMT, C0G(NP0), 1nF; Manufacturer: Murata Electronics; Manufacturer Part Number: GRM21B5C2J102JWA3L; Voltage Rating: 630VDC; Tolerance: 5%; Alternatives allowed: yes
C30 C34 C40 C43 C45 = CAP_10uF_0805: Multilayer Ceramic Capacitors MLCC - SMD/SMT, 10uF; Manufacturer: Samsung Electro-Mechanics; Manufacturer Part Number: CL21A106KAYNNNE; Voltage Rating: 25V; Tolerance: 10%; Alternatives allowed: yes; JLC: C15850
C35 C36 = CAP_8p_25V_0402: Multilayer Ceramic Capacitors MLCC - SMD/SMT 01005 25VDC 8pF Tol 0.1pF C0G; Manufacturer: Taiyo Yuden; Manufacturer Part Number: TMK042CG080BD-W; Voltage Rating: 25V; Alternatives allowed: YES; Notes: C0G, 0402
C38 C39 = CAP_10p_25V_0402: Multilayer Ceramic Capacitors MLCC - SMD/SMT 01005 25VDC 10pF Tol 0.5pF C0G; Manufacturer: Taiyo Yuden; Manufacturer Part Number: TMK042CG100DD-W; Voltage Rating: 25V; Alternatives allowed: YES; Notes: C0G, 0402
C48 = 100n_50V_0402: MLCC - SMD/SMT 100nF 50Volts 10%; Manufacturer: Yageo; Manufacturer Part Number: CC0402KRX5R9BB104; Voltage Rating: 50V; Tolerance: +-10%; Alternatives allowed: YES; Notes: X5R, 0402; Value: 100nF
C49 C50 = CAP_22u: Aluminium Electrolytic Capacitors - SMD 22UF 16V HA SMD; Manufacturer: Panasonic; Manufacturer Part Number: EEE-HAC220WAR; Tolerance: 20%; Alternatives allowed: NO; Voltage Rating: 16V
IC5 = IC_VS1010D-L: DSP audio microcontroller, QFP-48; Manufacturer: VLSI; Manufacturer Part Number: VS1010D-Q; Alternatives allowed: NO
IC6 = IC_SST25VF080B-50-4C-S2AF-T: NOR Flash 8M (1Mx8) 50MHz 2.7-3.6V Commercial; Manufacturer: Microchip Technology; Alternatives allowed: NO; Manufacturer Part Number: SST25VF080B-50-4C-S2AF-T
NT1 = NetTie_3mm: 3mm NetTie; Notes: PCB connection only
NT2 NT3 = NetTie_0.2mm: 0.2mmmm NetTie; Notes: PCB connection only
R4 = POT_10k_lin_dual_12mm_flat: Potentiometers 12MM V/ADJ ; 10KoHM; Manufacturer: Alps Alpine; Manufacturer Part Number: RK12L123000G; Tolerance: 20%
R13 R41 R43-R47 R50 R70-R72 R76 = RES_100k_0805: as R6 on sheet MCU; Tolerance: 1%; JLC: C17407
R40 = RES_47k_0805: Thick Film Resistors - SMD 1/8watt 47Kohms 1%; Manufacturer: Vishay / Dale; Manufacturer Part Number: CRCW080547K0FKEB; Voltage Rating: 150V; Alternatives allowed: YES; Tolerance: 1%; JLC: C17713
R42 R48 R57 R58 R79 R80 = RES_10k_0805: Thick Film Resistors - SMD 1/8watt 10Kohms 1% 100ppm; Manufacturer: Vishay / Dale; Manufacturer Part Number: CRCW080510K0FKEA; Voltage Rating: 150V; Alternatives allowed: YES; Tolerance: 1%; JLC: C17414
R49 R52 R54 R56 = 0805 0R (0R0) 1%: Chip resistor; Manufacturer Part Number: CRCW08050000Z0EAC; Manufacturer: Vishay / Dale; Alternatives allowed: YES; JLC: C17477; Tolerance: 1%
R51 R53 R55 = RES_470k_0805: Thick Film Resistors - SMD 1/8Watt 470Kohms 1% Commercial Use; Manufacturer: Vishay / Dale; Manufacturer Part Number: CRCW0805470KFKEAC; Voltage Rating: 150V; Alternatives allowed: YES; Tolerance: 1%; JLC: C17709
R59 R60 = RES_100k_0603: Thick Film Resistors - SMD 1/10Watt 100Kohms 1% Commercial Use; Manufacturer: Vishay; Manufacturer Part Number: CRCW0603100KFKEAC; Voltage Rating: 75V; Alternatives allowed: YES; Tolerance: 1%
R74 R75 R81 = RES_0R_0603: as R26 on sheet MCU
R77 R78 = RES_390R_0805: as R9 on sheet MCU; Tolerance: 1%; JLC: C17655
S1 = WE_430182070816: as S3 on sheet MCU; ComponentLink1Description: Manufacturer; ComponentLink1URL: http://www.we-online.de; ComponentLink2Description: Datasheet; ComponentLink2URL: https://katalog.we-online.com/em/datasheet/430182070816.pdf; Operating Temperature: -40 to +85degC; Part Number: 430182070816; Published Date: September 2019; Contact Material: Stainless Steel; Height: 7mm; Mounting Technology: SMT; Contact Plating: Silver; Operation Force: 160gf; Packaging: Tape and Reel; Terminal Material: Copper Alloy; Publisher: Wurth Elektronik; Terminal Plating: Silver
SW4-SW7 = SW_ TL1105DF160Q: as SW1 on sheet MCU; Manufacturer Part Number: TL1105DF160Q
T1 = T_BC850CLT1G: Bipolarer Einzeltransistor (BJT), NPN, 30 V, 100 MHz, 225 mW, 100 mA, 110 hFE; Manufacturer: ON SEMICONDUCTOR; Voltage Rating: 45V; Alternatives allowed: NO; Manufacturer Part Number: BC850CLT1G
X2 = Molex_104031-0811: Memory Card Connectors MICRO SD PUSH-PULL SMT 1.42MM HEIGHT; Manufacturer: Molex; Alternatives allowed: NO; Manufacturer Part Number: 104031-0811
X3 X15 = CON_HEADER_1X3: Board-to-Board-Steckverbinder, 2.54 mm, 3 Kontakt(e), Stiftleiste 1-Reihig; Manufacturer: Samtec; Manufacturer Part Number: TSW-103-07-T-S; Alternatives allowed: YES
XTAL1 = XTAL_ECS-122.8-10-33-AGL-TR: Crystals 12.288MHz 25ppm 10pF -10C +70C; Manufacturer: ECS; Alternatives allowed: NO; Manufacturer Part Number: ECS-122.8-10-33-AGL-TR
XTAL2 = XTAL_MC-146 32.7680KA-A3: PURE SN: Crystals 32.768KHz 9pF 20ppm -40c +85C; Manufacturer: Epson; Manufacturer Part Number: MC-146 32.768KA-AC3:ROHS; Alternatives allowed: NO; Supplier 1: Mouser; Supplier Part Number 1: 732-MC14632.76KAAC3R

## Nets that join several sheets
3V3: Connectors (C16.2 VR1.2 X4.3 X6.1), MCU (29 pins)
5V0: Connectors (7 pins), Audiocodec (C25.2 R40.2 R49.1)
GND: Connectors (13 pins), MCU (43 pins), Audiocodec (42 pins)
Button_1: MCU (R61.2), Audiocodec (IC5.28 R59.2 T1.C)
Button_2: MCU (R82.2), Audiocodec (5 pins)
Button_3: MCU (R62.2), Audiocodec (5 pins)
Button_4: MCU (R68.2), Audiocodec (5 pins)
NetIC1_30: Connectors (X8.1), MCU (IC1.30)
NetIC1_31: Connectors (X8.2), MCU (IC1.31)
Poti_1: MCU (IC1.14 R1.2 R67.2), Audiocodec (C11.2 R81.1)
Reset: Connectors (X6.5), MCU (5 pins)
SWCLK: Connectors (X6.3), MCU (IC1.37)
SWDIO: Connectors (X6.2), MCU (IC1.34)
UART2_RX: MCU (IC1.13), Audiocodec (R75.2)
UART2_TX: MCU (IC1.12), Audiocodec (R74.2)
USBD_N: Connectors (R23.1), Audiocodec (IC5.47 R53.2)
USBD_P: Connectors (R24.1), Audiocodec (IC5.46 R51.2)